# Altium project Lidar_MCU_4.PrjPcb
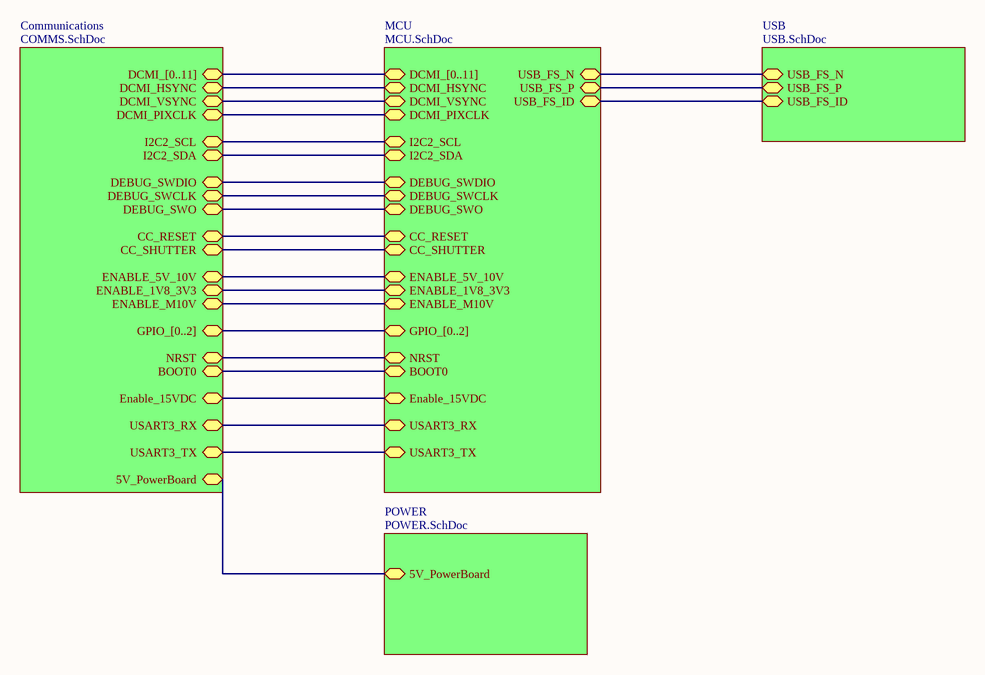
[diagram p0: Top_Level_MCU.SchDoc]
5 sheets, 42 parts. Net scope: hierarchical (ports join the sheet entries above them; power ports are global).
Board file: Lidar_MCU_PCB_4.PcbDoc
Sheets:
  Top_Level_MCU.SchDoc
    MCU = MCU.SchDoc
    USB = USB.SchDoc
    Communications = COMMS.SchDoc
    POWER = POWER.SchDoc

## Sheet Top_Level_MCU.SchDoc
size A; SheetNumber: 1; SheetTotal: 5

### Sub-sheets
Communications = COMMS.SchDoc: DCMI_[0..11] (bidir), DCMI_HSYNC (bidir), DCMI_VSYNC (bidir), DCMI_PIXCLK (bidir), I2C2_SCL (bidir), I2C2_SDA (bidir), DEBUG_SWDIO (bidir), DEBUG_SWCLK (bidir), DEBUG_SWO (bidir), CC_RESET (bidir), CC_SHUTTER (bidir), ENABLE_5V_10V (bidir), ENABLE_1V8_3V3 (bidir), ENABLE_M10V (bidir), GPIO_[0..2] (bidir), NRST (bidir), BOOT0 (bidir), Enable_15VDC (bidir), USART3_RX (bidir), USART3_TX (bidir), 5V_PowerBoard (bidir)
MCU = MCU.SchDoc: USB_FS_N (bidir), USB_FS_P (bidir), USB_FS_ID (bidir), DCMI_[0..11] (bidir), DCMI_HSYNC (bidir), DCMI_VSYNC (bidir), DCMI_PIXCLK (bidir), I2C2_SCL (bidir), I2C2_SDA (bidir), DEBUG_SWDIO (bidir), DEBUG_SWCLK (bidir), DEBUG_SWO (bidir), CC_RESET (bidir), CC_SHUTTER (bidir), ENABLE_5V_10V (bidir), ENABLE_1V8_3V3 (bidir), ENABLE_M10V (bidir), GPIO_[0..2] (bidir), NRST (bidir), BOOT0 (bidir), Enable_15VDC (bidir), USART3_RX (bidir), USART3_TX (bidir)
POWER = POWER.SchDoc: 5V_PowerBoard (bidir)
USB = USB.SchDoc: USB_FS_N (bidir), USB_FS_P (bidir), USB_FS_ID (bidir)

### Nets
BOOT0: sheet MCU/BOOT0, sheet Communications/BOOT0
CC_RESET: sheet MCU/CC_RESET, sheet Communications/CC_RESET
CC_SHUTTER: sheet MCU/CC_SHUTTER, sheet Communications/CC_SHUTTER
DCMI_HSYNC: sheet MCU/DCMI_HSYNC, sheet Communications/DCMI_HSYNC
DCMI_PIXCLK: sheet MCU/DCMI_PIXCLK, sheet Communications/DCMI_PIXCLK
DCMI_VSYNC: sheet MCU/DCMI_VSYNC, sheet Communications/DCMI_VSYNC
DEBUG_SWCLK: sheet MCU/DEBUG_SWCLK, sheet Communications/DEBUG_SWCLK
DEBUG_SWDIO: sheet MCU/DEBUG_SWDIO, sheet Communications/DEBUG_SWDIO
DEBUG_SWO: sheet MCU/DEBUG_SWO, sheet Communications/DEBUG_SWO
ENABLE_1V8_3V3: sheet MCU/ENABLE_1V8_3V3, sheet Communications/ENABLE_1V8_3V3
ENABLE_5V_10V: sheet MCU/ENABLE_5V_10V, sheet Communications/ENABLE_5V_10V
Enable_15VDC: sheet MCU/Enable_15VDC, sheet Communications/Enable_15VDC
ENABLE_M10V: sheet MCU/ENABLE_M10V, sheet Communications/ENABLE_M10V
I2C2_SCL: sheet MCU/I2C2_SCL, sheet Communications/I2C2_SCL
I2C2_SDA: sheet MCU/I2C2_SDA, sheet Communications/I2C2_SDA
USB_FS_ID: sheet MCU/USB_FS_ID, sheet USB/USB_FS_ID
USB_FS_N: sheet MCU/USB_FS_N, sheet USB/USB_FS_N
USB_FS_P: sheet MCU/USB_FS_P, sheet USB/USB_FS_P
NetC18_2: sheet Communications/5V_PowerBoard, sheet POWER/5V_PowerBoard
NetJ3_03: sheet MCU/NRST, sheet Communications/NRST
NetJ3_08: sheet MCU/USART3_RX, sheet Communications/USART3_RX
NetJ3_10: sheet MCU/USART3_TX, sheet Communications/USART3_TX

### Buses and harness runs
bus sheet Communications/DCMI_[0..11] = sheet MCU/DCMI_[0..11]
bus sheet Communications/GPIO_[0..2] = sheet MCU/GPIO_[0..2]

## Sheet MCU.SchDoc
size A3; SheetNumber: 2; SheetTotal: 5
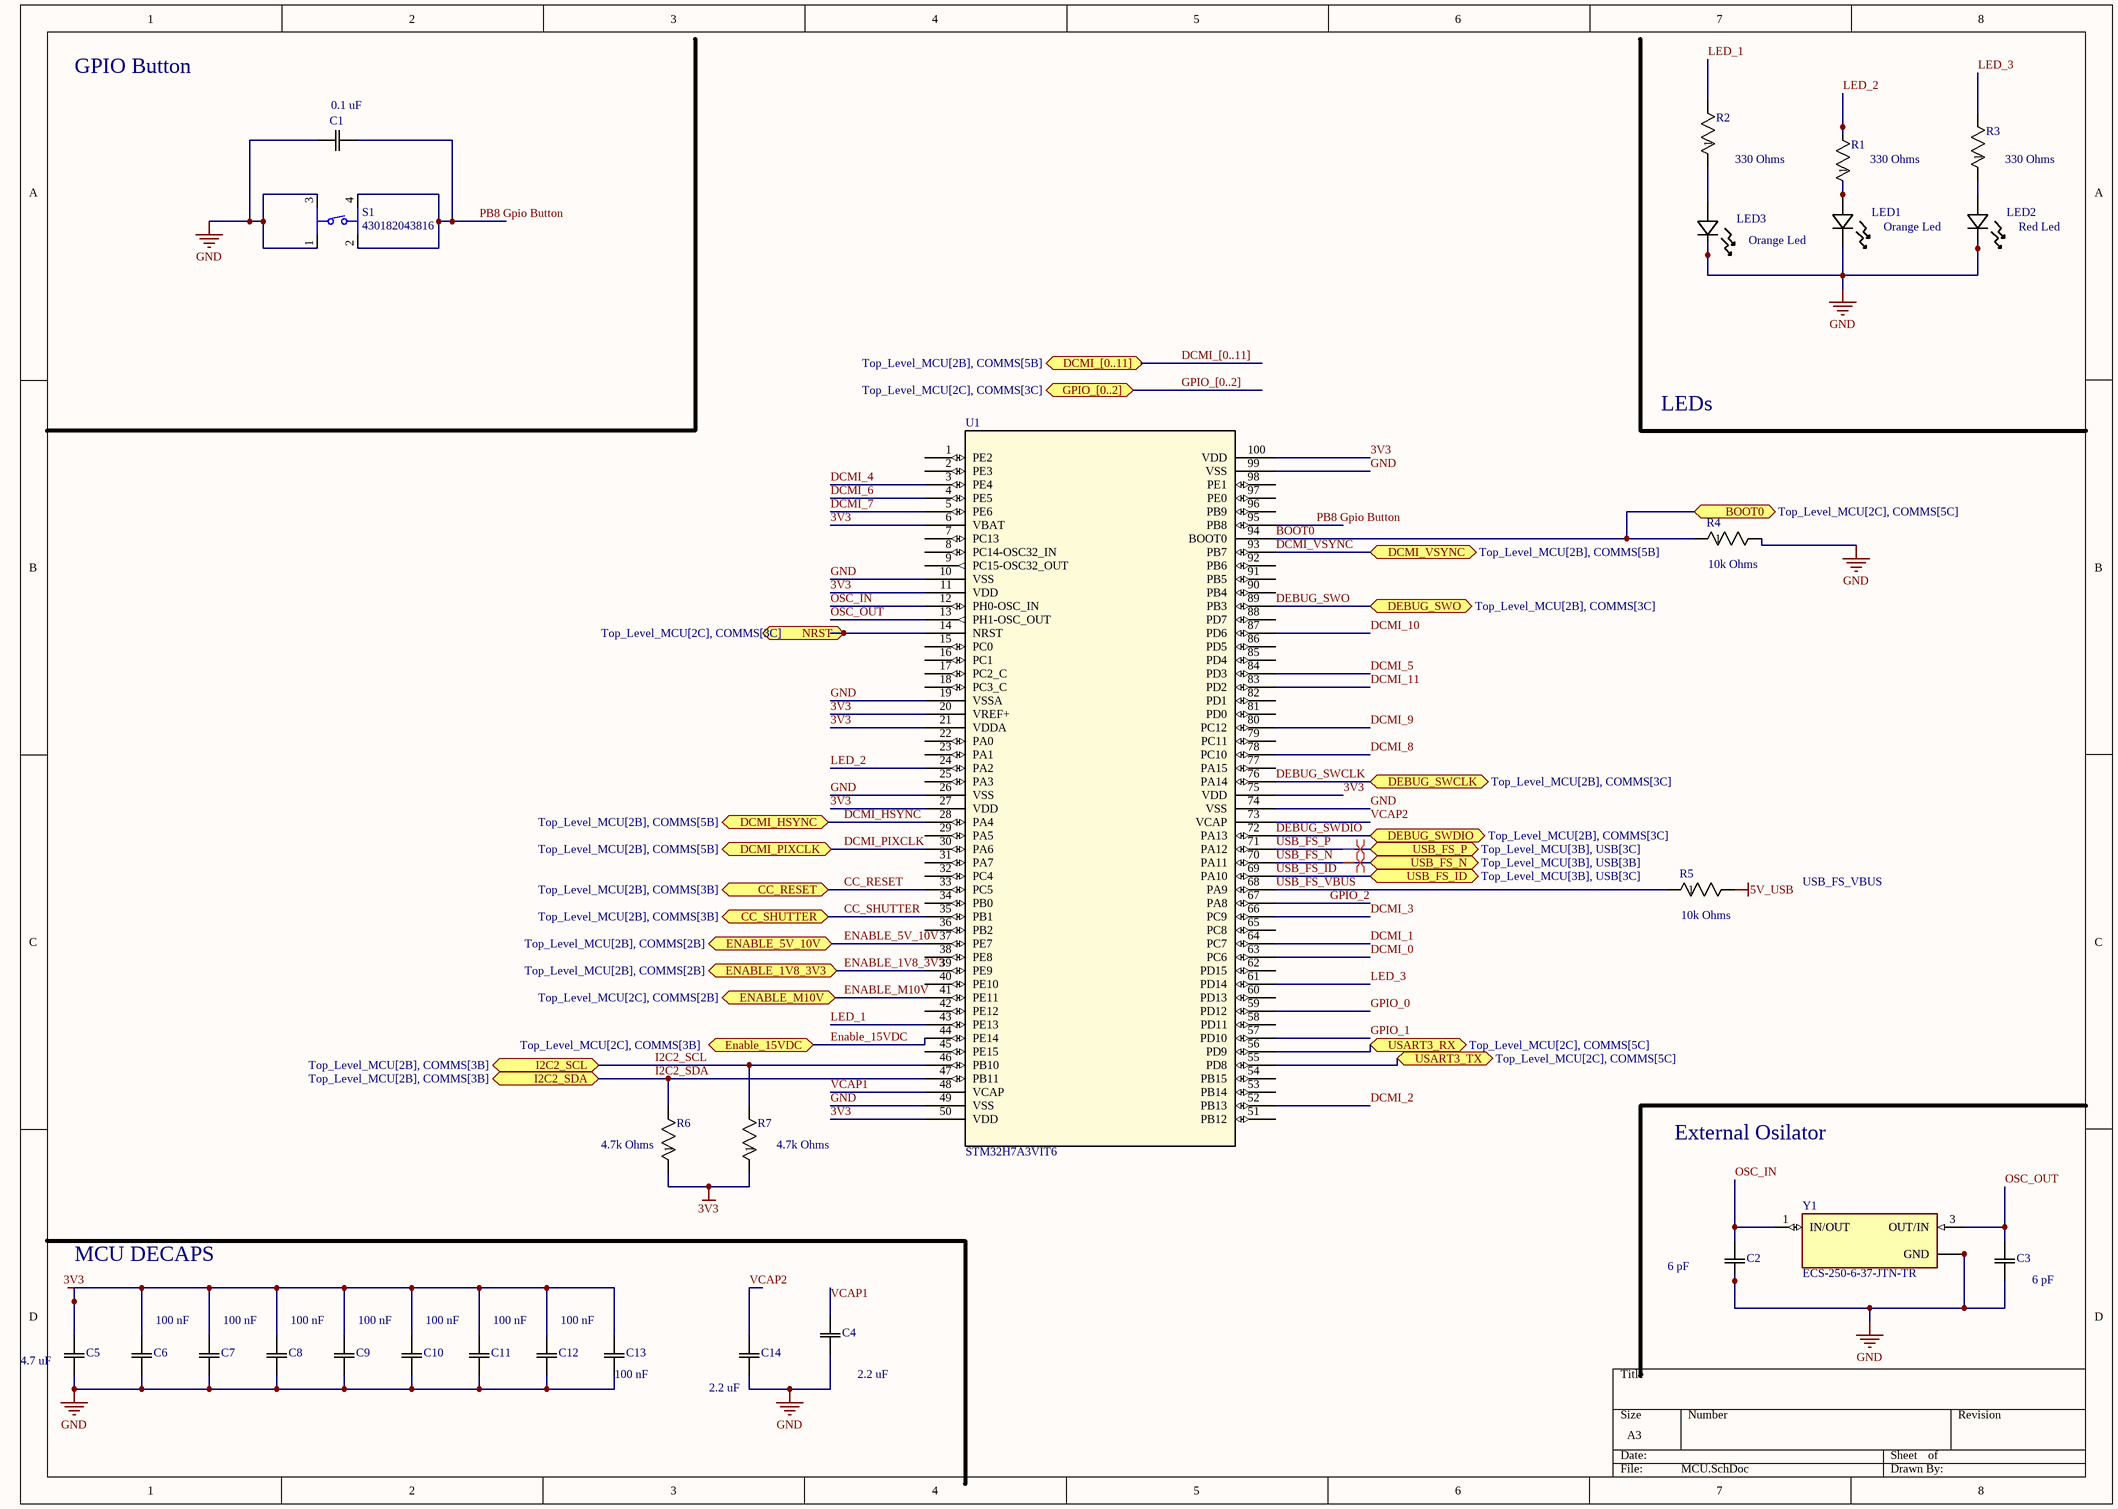
[diagram p1: MCU.SchDoc]

### Parts
C1  CC0805KRX7R7BB104  [CC0805N_YAG]  (value not drawn)
C2  CC0805KRX7R7BB104  [CC0805N_YAG]  (value not drawn)
C3  CC0805KRX7R7BB104  [CC0805N_YAG]  (value not drawn)
C4  CC0805KRX7R7BB104  [CC0805N_YAG]  (value not drawn)
C5  CC0805KRX7R7BB104  [CC0805N_YAG]  (value not drawn)
C6  CC0805KRX7R7BB104  [CC0805N_YAG]  (value not drawn)
C7  CC0805KRX7R7BB104  [CC0805N_YAG]  (value not drawn)
C8  CC0805KRX7R7BB104  [CC0805N_YAG]  (value not drawn)
C9  CC0805KRX7R7BB104  [CC0805N_YAG]  (value not drawn)
C10  CC0805KRX7R7BB104  [CC0805N_YAG]  (value not drawn)
C11  CC0805KRX7R7BB104  [CC0805N_YAG]  (value not drawn)
C12  CC0805KRX7R7BB104  [CC0805N_YAG]  (value not drawn)
C13  CC0805KRX7R7BB104  [CC0805N_YAG]  (value not drawn)
C14  CC0805KRX7R7BB104  [CC0805N_YAG]  (value not drawn)
LED1  LTST-C170KFKT  [LED_LTST-C170KFKT_LTO]  (value not drawn)
LED2  LTST-C171KRKT  [LED_LTST-C171_LTO]  (value not drawn)
LED3  LTST-C170KFKT  [LED_LTST-C170KFKT_LTO]  (value not drawn)
R1  RC0805FR-074K7L  [RES_RC0805_YAG]  (value not drawn)
R2  RC0805FR-074K7L  [RES_RC0805_YAG]  (value not drawn)
R3  RC0805FR-074K7L  [RES_RC0805_YAG]  (value not drawn)
R4  RC0805FR-074K7L  [RES_RC0805_YAG]  (value not drawn)
R5  RC0805FR-074K7L  [RES_RC0805_YAG]  (value not drawn)
R6  RC0805FR-074K7L  [RES_RC0805_YAG]  (value not drawn)
R7  RC0805FR-074K7L  [RES_RC0805_YAG]  (value not drawn)
S1  430182043816  [430182043816]
U1  STM32H7A3VIT6  [LQFP100]
Y1  ECS-250-6-37-JTN-TR  [XTAL_ECS-250-6-37-JTN-TR]

### Ports
BOOT0 (bidir, see Top_Level_MCU[2C], COMMS[5C]), CC_RESET (bidir, see Top_Level_MCU[2B], COMMS[3B]), CC_SHUTTER (bidir, see Top_Level_MCU[2B], COMMS[3B]), DCMI_[0..11] (bidir, see Top_Level_MCU[2B], COMMS[5B]), DCMI_HSYNC (bidir, see Top_Level_MCU[2B], COMMS[5B]), DCMI_PIXCLK (bidir, see Top_Level_MCU[2B], COMMS[5B]), DCMI_VSYNC (bidir, see Top_Level_MCU[2B], COMMS[5B]), DEBUG_SWCLK (bidir, see Top_Level_MCU[2B], COMMS[3C]), DEBUG_SWDIO (bidir, see Top_Level_MCU[2B], COMMS[3C]), DEBUG_SWO (bidir, see Top_Level_MCU[2B], COMMS[3C]), ENABLE_1V8_3V3 (bidir, see Top_Level_MCU[2B], COMMS[2B]), ENABLE_5V_10V (bidir, see Top_Level_MCU[2B], COMMS[2B]), Enable_15VDC (bidir, see Top_Level_MCU[2C], COMMS[3B]), ENABLE_M10V (bidir, see Top_Level_MCU[2C], COMMS[2B]), GPIO_[0..2] (bidir, see Top_Level_MCU[2C], COMMS[3C]), I2C2_SCL (bidir, see Top_Level_MCU[2B], COMMS[3B]), I2C2_SDA (bidir, see Top_Level_MCU[2B], COMMS[3B]), NRST (bidir, see Top_Level_MCU[2C], COMMS[3C]), USART3_RX (bidir, see Top_Level_MCU[2C], COMMS[5C]), USART3_TX (bidir, see Top_Level_MCU[2C], COMMS[5C]), USB_FS_ID (bidir, see Top_Level_MCU[3B], USB[3C]), USB_FS_N (bidir, see Top_Level_MCU[3B], USB[3B]), USB_FS_P (bidir, see Top_Level_MCU[3B], USB[3C])

### Nets
3V3: C5.2 C6.2 C7.2 C8.2 C9.2 C10.2 C11.2 C12.2 C13.2 R6.1 R7.1 U1.6(VBAT) U1.11(VDD) U1.20(VREF+) U1.21(VDDA) U1.27(VDD) U1.50(VDD) U1.75(VDD) U1.100(VDD)
5V_USB: R5.2
GND: C1.1 C2.1 C3.1 C4.1 C5.1 C6.1 C7.1 C8.1 C9.1 C10.1 C11.1 C12.1 C13.1 C14.1 LED1.1 LED2.1(CATHODE) LED3.1 R4.2 S1.1 S1.3 U1.10(VSS) U1.19(VSSA) U1.26(VSS) U1.49(VSS) U1.74(VSS) U1.99(VSS) Y1.2(GND) Y1.4(GND)
BOOT0: R4.1 U1.94(BOOT0) ; port BOOT0
CC_RESET: U1.33(PC5) ; port CC_RESET
CC_SHUTTER: U1.35(PB1) ; port CC_SHUTTER
DCMI_0: U1.63(PC6)
DCMI_1: U1.64(PC7)
DCMI_2: U1.52(PB13)
DCMI_3: U1.66(PC9)
DCMI_4: U1.3(PE4)
DCMI_5: U1.84(PD3)
DCMI_6: U1.4(PE5)
DCMI_7: U1.5(PE6)
DCMI_8: U1.78(PC10)
DCMI_9: U1.80(PC12)
DCMI_10: U1.87(PD6)
DCMI_11: U1.83(PD2)
DCMI_HSYNC: U1.28(PA4) ; port DCMI_HSYNC
DCMI_PIXCLK: U1.30(PA6) ; port DCMI_PIXCLK
DCMI_VSYNC: U1.93(PB7) ; port DCMI_VSYNC
DEBUG_SWCLK: U1.76(PA14) ; port DEBUG_SWCLK
DEBUG_SWDIO: U1.72(PA13) ; port DEBUG_SWDIO
DEBUG_SWO: U1.89(PB3) ; port DEBUG_SWO
ENABLE_1V8_3V3: U1.39(PE9) ; port ENABLE_1V8_3V3
ENABLE_5V_10V: U1.37(PE7) ; port ENABLE_5V_10V
Enable_15VDC: U1.44(PE14) ; port Enable_15VDC
ENABLE_M10V: U1.41(PE11) ; port ENABLE_M10V
GPIO_0: U1.59(PD12)
GPIO_1: U1.57(PD10)
GPIO_2: U1.67(PA8)
I2C2_SCL: R7.2 U1.46(PB10) ; port I2C2_SCL
I2C2_SDA: R6.2 U1.47(PB11) ; port I2C2_SDA
LED_1: R2.2 U1.43(PE13)
LED_2: R1.2 U1.24(PA2)
LED_3: R3.2 U1.61(PD14)
OSC_IN: C2.2 U1.12(PH0-OSC_IN) Y1.1(IN/OUT)
OSC_OUT: C3.2 U1.13(PH1-OSC_OUT) Y1.3(OUT/IN)
PB8 Gpio Button: C1.2 S1.2 S1.4 U1.95(PB8)
USB_FS_ID: U1.69(PA10) ; port USB_FS_ID
USB_FS_N: U1.70(PA11) ; port USB_FS_N
USB_FS_P: U1.71(PA12) ; port USB_FS_P
USB_FS_VBUS: R5.1 U1.68(PA9)
VCAP1: C4.2 U1.48(VCAP)
VCAP2: C14.2 U1.73(VCAP)
NetJ3_03: U1.14(NRST) ; port NRST
NetJ3_08: U1.56(PD9) ; port USART3_RX
NetJ3_10: U1.55(PD8) ; port USART3_TX
NetLED1_2: LED1.2 R1.1
NetLED2_2: LED2.2(ANODE) R3.1
NetLED3_2: LED3.2 R2.1

Not connected (* = marked no-connect by the designer): U1 1(PE2) 2(PE3) 7(PC13) 8(PC14-OSC32_IN) 9(PC15-OSC32_OUT) 15(PC0) 16(PC1) 17(PC2_C) 18(PC3_C) 22(PA0) 23(PA1) 25(PA3) 29(PA5) 31(PA7) 32(PC4) 34(PB0) 36(PB2) 38(PE8) 40(PE10) 42(PE12) 45(PE15) 51(PB12) 53(PB14) 54(PB15) 58(PD11) 60(PD13) 62(PD15) 65(PC8) 77(PA15) 79(PC11) 81(PD0) 82(PD1) 85(PD4) 86(PD5) 88(PD7) 90(PB4) 91(PB5) 92(PB6) 96(PB9) 97(PE0) 98(PE1)

### Buses and harness runs
bus DCMI_[0..11] = port DCMI_[0..11]
bus GPIO_[0..2] = port GPIO_[0..2]

### Layout directives
differential pair: USB_FS_N, USB_FS_P

### Notes on the sheet
- GPIO Button
- (near C1) 0.1 uF
- (near R2) 330 Ohms
- (near R1) 330 Ohms
- (near R3) 330 Ohms
- Orange Led
- (near LED2) Red Led
- LEDs
- (near R4) 10k Ohms
- (near R5) 10k Ohms
- USB_FS_VBUS
- (near R6) 4.7k Ohms
- (near R7) 4.7k Ohms
- External Osilator
- MCU DECAPS
- 100 nF
- (near C2) 6 pF
- (near C3) 6 pF
- (near C5) 4.7 uF
- (near C13) 100 nF
- (near C14) 2.2 uF
- (near C4) 2.2 uF

### Library data of the parts
C1-C14 = CC0805KRX7R7BB104: Description; Manufacturer_Name: Yageo; Copyright: Copyright (C) 2025 Ultra Librarian. All rights reserved.; Manufacturer_Part_Number: CC0805KRX7R7BB104
LED1 LED3 = LTST-C170KFKT: Description; Manufacturer_Name: LITE-ON; Copyright: Copyright (C) 2025 Ultra Librarian. All rights reserved.; Manufacturer_Part_Number: LTST-C170KFKT
LED2 = LTST-C171KRKT: Description; Manufacturer_Name: LITE-ON; Type: LED Indication; Copyright: Copyright (C) 2025 Ultra Librarian. All rights reserved.; Manufacturer_Part_Number: LTST-C171KRKT
R1-R7 = RC0805FR-074K7L: RES SMD 4.7 k? 1% 1/8W 0805; Manufacturer_Name: Yageo; Copyright: Copyright (C) 2025 Ultra Librarian. All rights reserved.; Manufacturer_Part_Number: RC0805FR-074K7L
S1 = 430182043816: 6*6mm vertical type, SMT, height 4.3mm, black actuator, 160gf, T&R; MF: Wurth Electronics; SnapEDA_Link: https://www.snapeda.com/parts/430182043816/Wurth+Electronics/view-part/?ref=snap; Package: None; Value: *; MP: 430182043816; Check_prices: https://www.snapeda.com/parts/430182043816/Wurth+Electronics/view-part/?ref=eda
U1 = STM32H7A3VIT6: High-performance and DSP with DP-FPU, Arm Cortex-M7  MCU with 2MBytes of Flash memory, 1376 KB SRAM, 280 MHz CPU, L1 cache, graphic accelerations, external memory interfaces, SMPS and large set of peripherals; Manufacturer_Name: STMicroelectronics; Copyright: Copyright (C) 2025 Ultra Librarian. All rights reserved.; Manufacturer_Part_Number: STM32H7A3VIT6; RefDes: RefDes; Type: Type
Y1 = ECS-250-6-37-JTN-TR: SMD Crystal 2.0 x 1.6 x 0.45 mm ceramic package; Package: None; Price: None; Value: *; MP: ECS-250-6-37-JTN-TR; Availability: Unavailable; ComponentLink1Description: New link; ComponentLink1URL: *

## Sheet USB.SchDoc
size A3; SheetNumber: 3; SheetTotal: 5
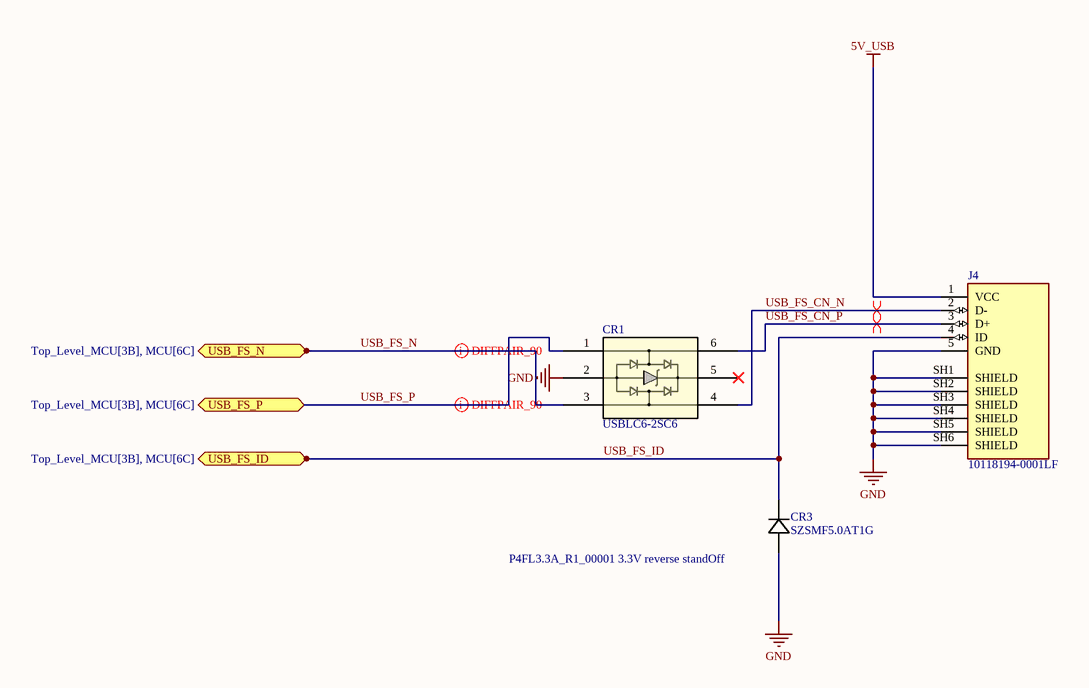
[diagram p2: USB.SchDoc]

### Parts
CR1  USBLC6-2SC6  [SOT23-6L_STM]
CR3  SZSMF5.0AT1G  [CR_SZSMF_LTF]
J4  10118194-0001LF  [AMPHENOL_10118194-0001LF]

### Ports
USB_FS_ID (bidir, see Top_Level_MCU[3B], MCU[6C]), USB_FS_N (bidir, see Top_Level_MCU[3B], MCU[6C]), USB_FS_P (bidir, see Top_Level_MCU[3B], MCU[6C])

### Nets
5V_USB: J4.1(VCC)
GND: CR1.2 CR3.2 J4.5(GND) J4.SH1(SHIELD) J4.SH2(SHIELD) J4.SH3(SHIELD) J4.SH4(SHIELD) J4.SH5(SHIELD) J4.SH6(SHIELD)
USB_FS_CN_N: CR1.4 J4.2(D-)
USB_FS_CN_P: CR1.6 J4.3(D+)
USB_FS_ID: CR3.1 J4.4(ID) ; port USB_FS_ID
USB_FS_N: CR1.3 ; port USB_FS_N
USB_FS_P: CR1.1 ; port USB_FS_P

Not connected (* = marked no-connect by the designer): CR1 5*

### Layout directives
differential pair: USB_FS_CN_N, USB_FS_CN_P, USB_FS_N, USB_FS_P

### Notes on the sheet
- (near CR3) P4FL3.3A_R1_00001 3.3V reverse standOff

### Library data of the parts
CR1 = USBLC6-2SC6: ESD Protection for USB 2.0 High Speed; Manufacturer_Name: STMicroelectronics; Copyright: Copyright (C) 2025 Ultra Librarian. All rights reserved.; Manufacturer_Part_Number: USBLC6-2SC6; RefDes: RefDes; Type: Type
CR3 = SZSMF5.0AT1G: Description; Manufacturer_Name: Littelfuse Inc; Copyright: Copyright (C) 2025 Ultra Librarian. All rights reserved.; Manufacturer_Part_Number: SZSMF5.0AT1G
J4 = 10118194-0001LF: Micro USB, Input Output Connectors, B TYPE RECEPTACLE with flange; MF: Amphenol ICC; SnapEDA_Link: https://www.snapeda.com/parts/10118194-0001LF/Amphenol+FCI/view-part/?ref=snap; Package: None; Value: *; MP: 10118194-0001LF; Check_prices: https://www.snapeda.com/parts/10118194-0001LF/Amphenol+FCI/view-part/?ref=eda

## Sheet COMMS.SchDoc
size A3; SheetNumber: 4; SheetTotal: 5
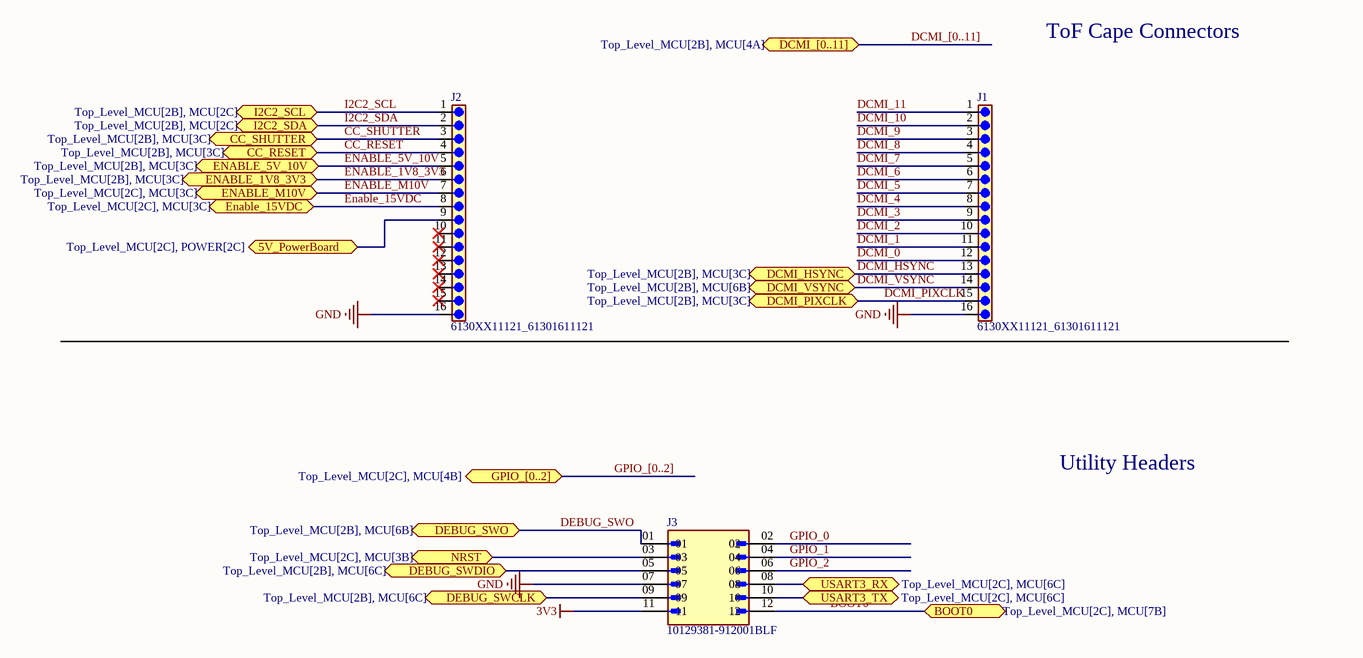
[diagram p3: COMMS.SchDoc]

### Parts
J1  6130XX11121_61301611121  [61301611121]
J2  6130XX11121_61301611121  [61301611121]
J3  10129381-912001BLF  [AMPHENOL_10129381-912001BLF]

### Ports
5V_PowerBoard (bidir, see Top_Level_MCU[2C], POWER[2C]), BOOT0 (bidir, see Top_Level_MCU[2C], MCU[7B]), CC_RESET (bidir, see Top_Level_MCU[2B], MCU[3C]), CC_SHUTTER (bidir, see Top_Level_MCU[2B], MCU[3C]), DCMI_[0..11] (bidir, see Top_Level_MCU[2B], MCU[4A]), DCMI_HSYNC (bidir, see Top_Level_MCU[2B], MCU[3C]), DCMI_PIXCLK (bidir, see Top_Level_MCU[2B], MCU[3C]), DCMI_VSYNC (bidir, see Top_Level_MCU[2B], MCU[6B]), DEBUG_SWCLK (bidir, see Top_Level_MCU[2B], MCU[6C]), DEBUG_SWDIO (bidir, see Top_Level_MCU[2B], MCU[6C]), DEBUG_SWO (bidir, see Top_Level_MCU[2B], MCU[6B]), ENABLE_1V8_3V3 (bidir, see Top_Level_MCU[2B], MCU[3C]), ENABLE_5V_10V (bidir, see Top_Level_MCU[2B], MCU[3C]), Enable_15VDC (bidir, see Top_Level_MCU[2C], MCU[3C]), ENABLE_M10V (bidir, see Top_Level_MCU[2C], MCU[3C]), GPIO_[0..2] (bidir, see Top_Level_MCU[2C], MCU[4B]), I2C2_SCL (bidir, see Top_Level_MCU[2B], MCU[2C]), I2C2_SDA (bidir, see Top_Level_MCU[2B], MCU[2C]), NRST (bidir, see Top_Level_MCU[2C], MCU[3B]), USART3_RX (bidir, see Top_Level_MCU[2C], MCU[6C]), USART3_TX (bidir, see Top_Level_MCU[2C], MCU[6C])

### Nets
3V3: J3.11
GND: J1.16 J2.16 J3.07
BOOT0: J3.12 ; port BOOT0
CC_RESET: J2.4 ; port CC_RESET
CC_SHUTTER: J2.3 ; port CC_SHUTTER
DCMI_0: J1.12
DCMI_1: J1.11
DCMI_2: J1.10
DCMI_3: J1.9
DCMI_4: J1.8
DCMI_5: J1.7
DCMI_6: J1.6
DCMI_7: J1.5
DCMI_8: J1.4
DCMI_9: J1.3
DCMI_10: J1.2
DCMI_11: J1.1
DCMI_HSYNC: J1.13 ; port DCMI_HSYNC
DCMI_PIXCLK: J1.15 ; port DCMI_PIXCLK
DCMI_VSYNC: J1.14 ; port DCMI_VSYNC
DEBUG_SWCLK: J3.09 ; port DEBUG_SWCLK
DEBUG_SWDIO: J3.05 ; port DEBUG_SWDIO
DEBUG_SWO: J3.01 ; port DEBUG_SWO
ENABLE_1V8_3V3: J2.6 ; port ENABLE_1V8_3V3
ENABLE_5V_10V: J2.5 ; port ENABLE_5V_10V
Enable_15VDC: J2.8 ; port Enable_15VDC
ENABLE_M10V: J2.7 ; port ENABLE_M10V
GPIO_0: J3.02
GPIO_1: J3.04
GPIO_2: J3.06
I2C2_SCL: J2.1 ; port I2C2_SCL
I2C2_SDA: J2.2 ; port I2C2_SDA
NetC18_2: J2.9 ; port 5V_PowerBoard
NetJ3_03: J3.03 ; port NRST
NetJ3_08: J3.08 ; port USART3_RX
NetJ3_10: J3.10 ; port USART3_TX

Not connected (* = marked no-connect by the designer): J2 10* 11* 12* 13* 14* 15*

### Buses and harness runs
bus DCMI_[0..11] = port DCMI_[0..11]
bus GPIO_[0..2] = port GPIO_[0..2]

### Notes on the sheet
- ToF Cape Connectors
- Utility Headers

### Library data of the parts
J1 J2 = 6130XX11121_61301611121: MF: {'manufacturer': u'Wurth Electronics'}; Package: None; Price: None; Value: *; MP: 61301611121; Availability: Unavailable
J3 = 10129381-912001BLF: EconoStikâ„¢, Board to Board connector, Unshrouded Vertical Header, Through Hole, Double Row, 12 Positions, 2.54 mm (0.100in) Pitch.; MF: Amphenol ICC (FCI); Check_prices: https://www.snapeda.com/parts/10129381-912001BLF/Amphenol+FCI/view-part/?ref=eda; SnapEDA_Link: https://www.snapeda.com/parts/10129381-912001BLF/Amphenol+FCI/view-part/?ref=snap; Value: *; Purchase-URL: https://pricing.snapeda.com/search/part/10129381-912001BLF/?ref=eda; Package: None; MP: 10129381-912001BLF; Digi-Key_Part_Number: 10129381-912001BLF-ND

## Sheet POWER.SchDoc
size A3; SheetNumber: 5; SheetTotal: 5
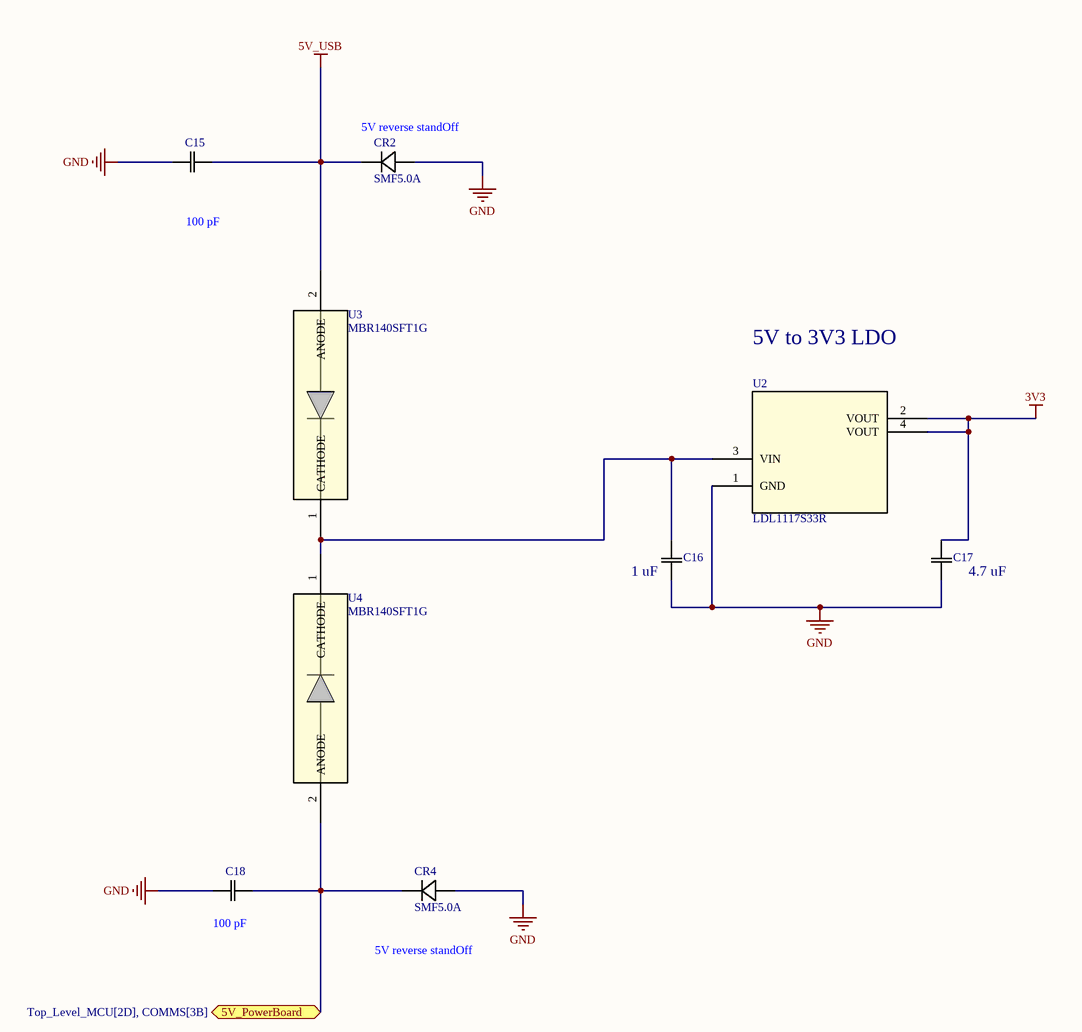
[diagram p4: POWER.SchDoc]

### Parts
C15  CC0805KRX7R7BB104  [CC0805N_YAG]  (value not drawn)
C16  CC0805KRX7R7BB104  [CC0805N_YAG]  (value not drawn)
C17  CC0805KRX7R7BB104  [CC0805N_YAG]  (value not drawn)
C18  CC0805KRX7R7BB104  [CC0805N_YAG]  (value not drawn)
CR2  SMF5.0A  [SMFSeries_LTF]
CR4  SMF5.0A  [SMFSeries_LTF]
U2  LDL1117S33R  [SOT223_STM]
U3  MBR140SFT1G  [SOD_40SFT1G_ONS]
U4  MBR140SFT1G  [SOD_40SFT1G_ONS]

### Ports
5V_PowerBoard (bidir, see Top_Level_MCU[2D], COMMS[3B])

### Nets
3V3: C17.2 U2.2(VOUT) U2.4(VOUT)
5V_USB: C15.2 CR2.1 U3.2(ANODE)
GND: C15.1 C16.1 C17.1 C18.1 CR2.2 CR4.2 U2.1(GND)
NetC16_2: C16.2 U2.3(VIN) U3.1(CATHODE) U4.1(CATHODE)
NetC18_2: C18.2 CR4.1 U4.2(ANODE) ; port 5V_PowerBoard

### Notes on the sheet
- (near CR2) 5V reverse standOff
- (near C15) 100 pF
- 5V to 3V3 LDO
- (near C16) 1 uF
- (near C17) 4.7 uF
- (near C18) 100 pF
- (near CR4) 5V reverse standOff

### Library data of the parts
C15-C18 = CC0805KRX7R7BB104: Description; Manufacturer_Name: Yageo; Copyright: Copyright (C) 2025 Ultra Librarian. All rights reserved.; Manufacturer_Part_Number: CC0805KRX7R7BB104
CR2 CR4 = SMF5.0A: Description; Manufacturer_Name: Littelfuse Inc; Copyright: Copyright (C) 2025 Ultra Librarian. All rights reserved.; Manufacturer_Part_Number: SMF5.0A
U2 = LDL1117S33R: 1.2 A High PSRR low dropout linear voltage regulator; Manufacturer_Name: STMicroelectronics; Copyright: Copyright (C) 2025 Ultra Librarian. All rights reserved.; Manufacturer_Part_Number: LDL1117S33R; RefDes: RefDes; Type: Type
U3 U4 = MBR140SFT1G: Description; Manufacturer_Name: onsemi; Copyright: Copyright (C) 2026 Ultra Librarian. All rights reserved.; Manufacturer_Part_Number: MBR140SFT1G; RefDes: RefDes; Type: Type

## Nets that join several sheets
3V3: MCU (19 pins), COMMS (J3.11), POWER (C17.2 U2.2 U2.4)
5V_USB: MCU (R5.2), USB (J4.1), POWER (C15.2 CR2.1 U3.2)
GND: MCU (28 pins), USB (9 pins), COMMS (J1.16 J2.16 J3.07), POWER (7 pins)
BOOT0: MCU (R4.1 U1.94), COMMS (J3.12)
CC_RESET: MCU (U1.33), COMMS (J2.4)
CC_SHUTTER: MCU (U1.35), COMMS (J2.3)
DCMI_0: MCU (U1.63), COMMS (J1.12)
DCMI_1: MCU (U1.64), COMMS (J1.11)
DCMI_2: MCU (U1.52), COMMS (J1.10)
DCMI_3: MCU (U1.66), COMMS (J1.9)
DCMI_4: MCU (U1.3), COMMS (J1.8)
DCMI_5: MCU (U1.84), COMMS (J1.7)
DCMI_6: MCU (U1.4), COMMS (J1.6)
DCMI_7: MCU (U1.5), COMMS (J1.5)
DCMI_8: MCU (U1.78), COMMS (J1.4)
DCMI_9: MCU (U1.80), COMMS (J1.3)
DCMI_10: MCU (U1.87), COMMS (J1.2)
DCMI_11: MCU (U1.83), COMMS (J1.1)
DCMI_HSYNC: MCU (U1.28), COMMS (J1.13)
DCMI_PIXCLK: MCU (U1.30), COMMS (J1.15)
DCMI_VSYNC: MCU (U1.93), COMMS (J1.14)
DEBUG_SWCLK: MCU (U1.76), COMMS (J3.09)
DEBUG_SWDIO: MCU (U1.72), COMMS (J3.05)
DEBUG_SWO: MCU (U1.89), COMMS (J3.01)
ENABLE_1V8_3V3: MCU (U1.39), COMMS (J2.6)
ENABLE_5V_10V: MCU (U1.37), COMMS (J2.5)
Enable_15VDC: MCU (U1.44), COMMS (J2.8)
ENABLE_M10V: MCU (U1.41), COMMS (J2.7)
GPIO_0: MCU (U1.59), COMMS (J3.02)
GPIO_1: MCU (U1.57), COMMS (J3.04)
GPIO_2: MCU (U1.67), COMMS (J3.06)
I2C2_SCL: MCU (R7.2 U1.46), COMMS (J2.1)
I2C2_SDA: MCU (R6.2 U1.47), COMMS (J2.2)
NetC18_2: COMMS (J2.9), POWER (C18.2 CR4.1 U4.2)
NetJ3_03: MCU (U1.14), COMMS (J3.03)
NetJ3_08: MCU (U1.56), COMMS (J3.08)
NetJ3_10: MCU (U1.55), COMMS (J3.10)
USB_FS_ID: MCU (U1.69), USB (CR3.1 J4.4)
USB_FS_N: MCU (U1.70), USB (CR1.3)
USB_FS_P: MCU (U1.71), USB (CR1.1)